# Altium schematic sheet LCmeter0-LCD-8pinlcd_1.SchDoc
size 272 x 120 mm
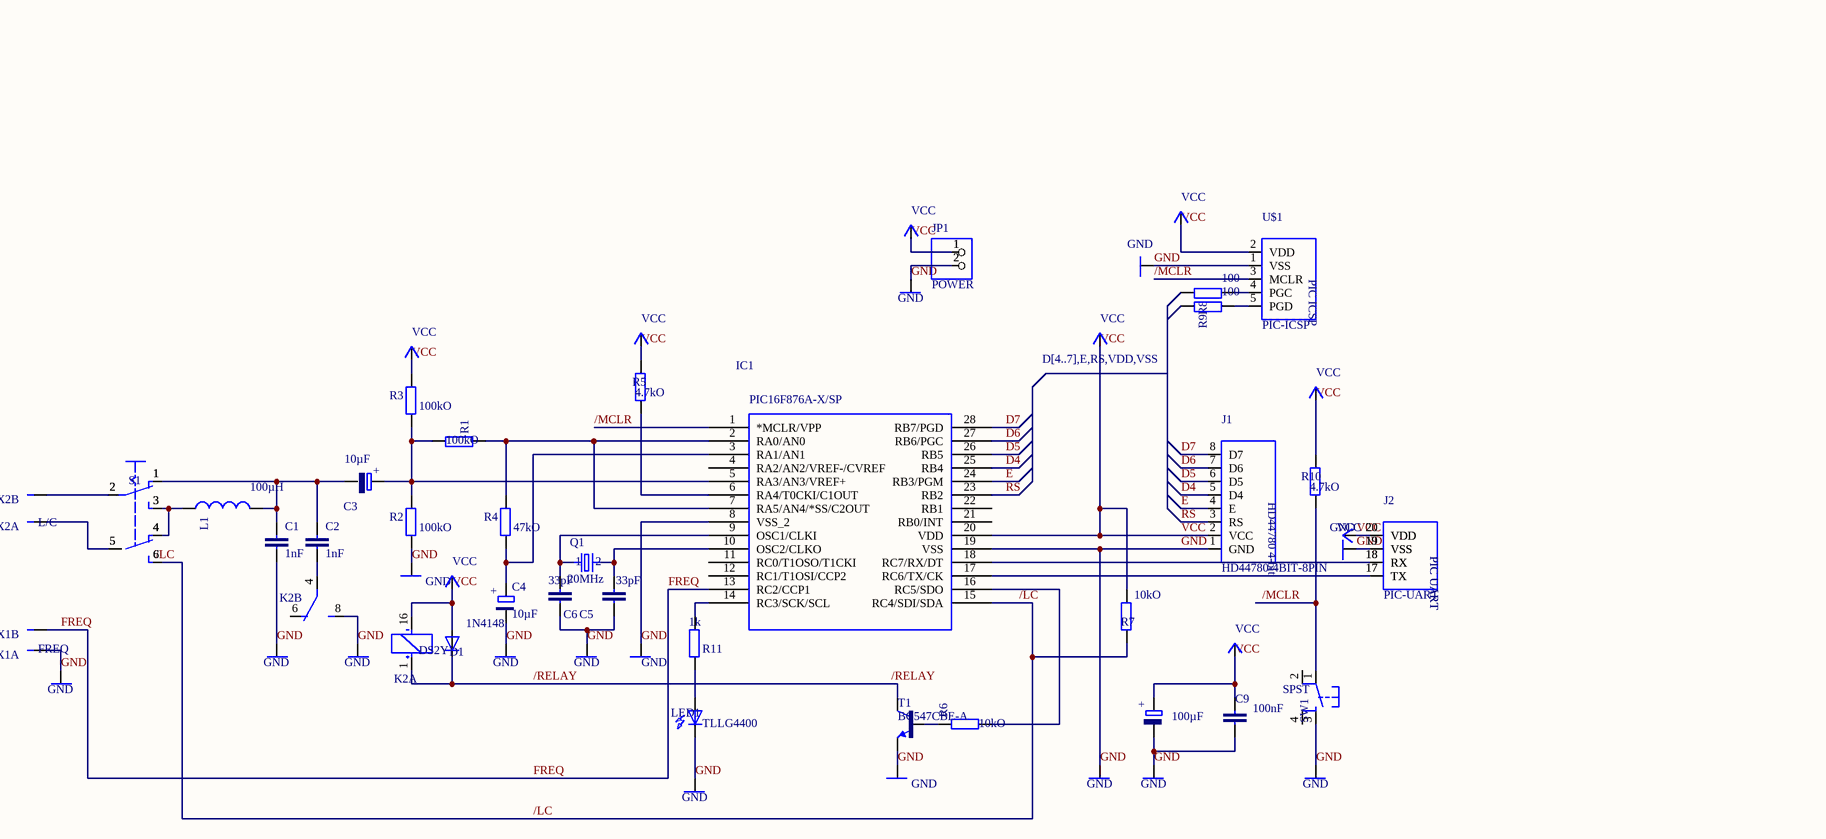
[diagram p0: LCmeter0-LCD-8pinlcd_1.SchDoc]

## Parts
C1  1nF  [C050-020X036]
C2  1nF  [C050-020X036]
C3  10µF  [E5-4]
C4  10µF  [E5-4]
C5  33pF  [C025-020X036]
C6  33pF  [C025-020X036]
C7  100µF  [E2,5-6]
C9  100nF  [C025-024X044]
D1  1N4148  [DO34-7]
GND1  GND
GND2  GND
GND3  GND
GND4  GND
GND5  GND
GND6  GND
GND7  GND
GND8  GND
GND9  GND
GND10  GND
GND11  GND
GND12  GND
GND13  GND
GND14  GND
GND15  GND
IC1  PIC16F876A-X/SP  [DIL28-3]
J1  HD44780-4BIT-8PIN  [CONN-8P]
J2  PIC-UART  [PIC-UART]
JP1  POWER  [1X02]
K2  DS2Y  [DS2Y]  (parts A,B of 3)
L1  100µH  [L-02/7]
LED1  TLLG4400  [LED3MM]
P+1  VCC
P+2  VCC
P+3  VCC
P+4  VCC
P+5  VCC
P+6  VCC
P+7  VCC
P+8  VCC
P+9  VCC
Q1  20MHz  [HC49]
R1  100kO  [0202/2V]
R2  100kO  [0202/7]
R3  100kO  [0202/2V]
R4  47kO  [0202/2V]
R5  4.7kO  [0202/7]
R6  10kO  [0202/7]
R7  10kO  [0202/10]
R8  100  [0202/5]
R9  100  [0202/5]
R10  4.7kO  [0202/2V]
R11  1k  [0202/5]
S1  (no value)  [SLSW-2P2T]
SW1  SPST  [PB-5]
T1  BC547CBE-A  [TO92-CBE-A]
U$1  PIC-ICSP  [CONN-5P]
X1  FREQ  [70543-02]  (parts A,B of 2)
X2  L/C  [70543-02]  (parts A,B of 2)

## Nets
/LC: IC1.15(RC4/SDI/SDA) R7.2 S1.6(S1)
/MCLR: IC1.1(*MCLR/VPP) R10.1 SW1.1(P) U$1.3(MCLR)
/RELAY: D1.C K2.1(+) T1.C
D4: IC1.25(RB4) J1.5(D4)
D5: IC1.26(RB5) J1.6(D5)
D6: IC1.27(RB6/PGC) J1.7(D6)
D7: IC1.28(RB7/PGD) J1.8(D7)
E: IC1.24(RB3/PGM) J1.4(E)
FREQ: IC1.13(RC2/CCP1) X1.2(S)
GND: C1.2 C4.- C5.1 C6.1 C7.- C9.2 GND1.0(GND) GND2.0(GND) GND3.0(GND) GND4.0(GND) GND5.0(GND) GND6.0(GND) GND7.0(GND) GND8.0(GND) GND9.0(GND) GND10.0(GND) GND11.0(GND) GND12.0(GND) GND13.0(GND) GND14.0(GND) GND15.0(GND) IC1.8(VSS_2) IC1.19(VSS) J1.1(GND) J2.19(VSS) JP1.2 K2.8(S) LED1.K(C) R2.1 SW1.3(S) T1.E U$1.1(VSS) X1.1(S)
RS: IC1.23(RB2) J1.3(RS)
VCC: C7.+ C9.1 D1.A IC1.20(VDD) J1.2(VCC) J2.20(VDD) JP1.1 K2.16(-) P+1.0(VCC) P+2.0(VCC) P+3.0(VCC) P+4.0(VCC) P+5.0(VCC) P+6.0(VCC) P+7.0(VCC) P+8.0(VCC) P+9.0(VCC) R3.2 R5.2 R7.1 R10.2 U$1.2(VDD)
NetC1_1: C1.1 C2.1 C3.- L1.2 S1.1(O)
NetC2_2: C2.2 K2.4(P)
NetC3_+: C3.+ IC1.5(RA3/AN3/VREF+) R1.1 R2.2 R3.1
NetC4_+: C4.+ IC1.3(RA1/AN1) R4.1
NetC5_2: C5.2 IC1.10(OSC2/CLKO) Q1.2
NetC6_2: C6.2 IC1.9(OSC1/CLKI) Q1.1
NetIC1_2: IC1.2(RA0/AN0) IC1.7(RA5/AN4/*SS/C2OUT) R1.2 R4.2
NetIC1_6: IC1.6(RA4/T0CKI/C1OUT) R5.1
NetIC1_14: IC1.14(RC3/SCK/SCL) R11.1
NetIC1_16: IC1.16(RC5/SDO) R6.1
NetIC1_17: IC1.17(RC6/TX/CK) J2.17(TX)
NetIC1_18: IC1.18(RC7/RX/DT) J2.18(RX)
NetL1_1: L1.1 S1.3(S) S1.4(O1)
NetLED1_A: LED1.A R11.2
NetR6_2: R6.2 T1.B
NetR8_1: R8.1 U$1.4(PGC)
NetR9_1: R9.1 U$1.5(PGD)
NetS1_2: S1.2(P) X2.2(S)
NetS1_5: S1.5(P1) X2.1(S)

Not connected (* = marked no-connect by the designer): IC1 4(RA2/AN2/VREF-/CVREF) 11(RC0/T1OSO/T1CKI) 12(RC1/T1OSI/CCP2) 21(RB0/INT) 22(RB1); K2 6(O); R8 2; R9 2; SW1 2(P1) 4(S1)

## Notes on the sheet
- (near P+6) D[4..7],E,RS,VDD,VSS
- Labels drawn without touching a wire or pin: /LC
- (in symbol HD44780-4BIT-8PIN) HD44780 4-bit
- (in symbol PIC-ICSP) PIC ICSP
- (in symbol PIC-UART) PIC UART

## Library data of the parts
C1 C2 = C050-020X036
C3 C4 = CPOLE5-4
C5 C6 = C025-020X036
C7 = CPOLE2.5-6
C9 = C-EU025-024X044
D1 = 1N414834-7
JP1 = PINHD-1X2
K2 = DS2Y-S-DC5V
L1 = L02/7
Q1 = CRYSTALHC49
R1 R3 R4 R10 = R0202/2V
R2 R5 R6 = R0202/7
R7 = R0202/10
R8 R9 R11 = R0202/5
S1 = SL-SW-2P-2T
SW1 = PB-SPST
X1 X2 = C-GRID-02-70543